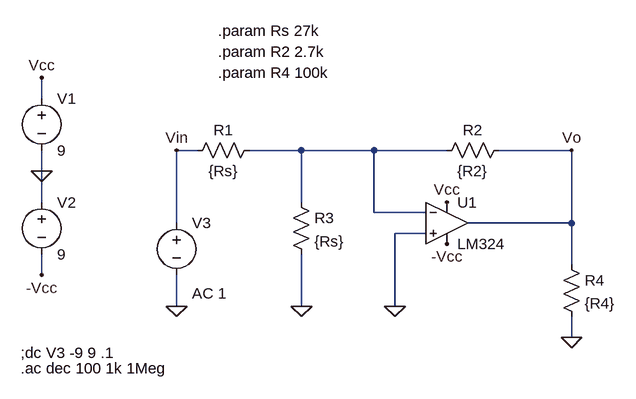
[diagram p0: schematic Inversor_Caso3.asc]
Inversor_Caso3.asc, the LTspice schematic file:
Version 4
SHEET 1 880 680
WIRE -32 64 -32 32
WIRE 208 144 176 144
WIRE 368 144 288 144
WIRE 480 144 368 144
WIRE 592 144 480 144
WIRE 784 144 672 144
WIRE -32 176 -32 144
WIRE -32 224 -32 176
WIRE 368 224 368 144
WIRE 480 240 480 144
WIRE 560 240 480 240
WIRE 176 256 176 144
WIRE 784 256 784 144
WIRE 784 256 624 256
WIRE 560 272 512 272
WIRE 784 320 784 256
WIRE -32 336 -32 304
WIRE 176 384 176 336
WIRE 368 384 368 304
WIRE 512 384 512 272
WIRE 784 432 784 400
FLAG -32 176 0
FLAG -32 32 Vcc
FLAG -32 336 -Vcc
FLAG 592 224 Vcc
FLAG 592 288 -Vcc
FLAG 176 384 0
FLAG 368 384 0
FLAG 784 432 0
FLAG 512 384 0
FLAG 784 144 Vo
FLAG 176 144 Vin
SYMBOL sympropio\\LM324 592 192 R0
SYMATTR InstName U1
SYMBOL voltage -32 48 R0
WINDOW 123 0 0 Left 0
WINDOW 39 0 0 Left 0
SYMATTR InstName V1
SYMATTR Value 9
SYMBOL voltage -32 208 R0
WINDOW 123 0 0 Left 0
WINDOW 39 0 0 Left 0
SYMATTR InstName V2
SYMATTR Value 9
SYMBOL voltage 176 240 R0
WINDOW 123 24 124 Left 2
WINDOW 39 0 0 Left 0
SYMATTR Value2 AC 1
SYMATTR InstName V3
SYMATTR Value ""
SYMBOL res 304 128 R90
WINDOW 0 0 56 VBottom 2
WINDOW 3 32 56 VTop 2
SYMATTR InstName R1
SYMATTR Value {Rs}
SYMBOL res 352 208 R0
SYMATTR InstName R3
SYMATTR Value {Rs}
SYMBOL res 688 128 R90
WINDOW 0 0 56 VBottom 2
WINDOW 3 32 56 VTop 2
SYMATTR InstName R2
SYMATTR Value {R2}
SYMBOL res 768 304 R0
SYMATTR InstName R4
SYMATTR Value {R4}
TEXT 240 -40 Left 2 !.param Rs 27k
TEXT 240 -8 Left 2 !.param R2 2.7k
TEXT 240 24 Left 2 !.param R4 100k
TEXT -64 456 Left 2 !;dc V3 -9 9 .1
TEXT -64 480 Left 2 !.ac dec 100 1k 1Meg

The netlist it stands for:
* Inversor_Caso3.asc
* U1: LM324 (symbol sympropio\LM324 not available, pins judged from their places): In+=0 In-=N001 V+=Vcc V-=-Vcc OUT=Vo
V1 Vcc 0 9
V2 0 -Vcc 9
V3 Vin 0 AC 1
R1 N001 Vin {Rs}
R3 N001 0 {Rs}
R2 Vo N001 {R2}
R4 Vo 0 {R4}
.param Rs 27k
.param R2 2.7k
.param R4 100k
;dc V3 -9 9 .1
.ac dec 100 1k 1Meg
.backanno
.end